# EAGLE schematic RX8E+ulrich (EAGLE 6.6.0)

## Sheet 1 of 4
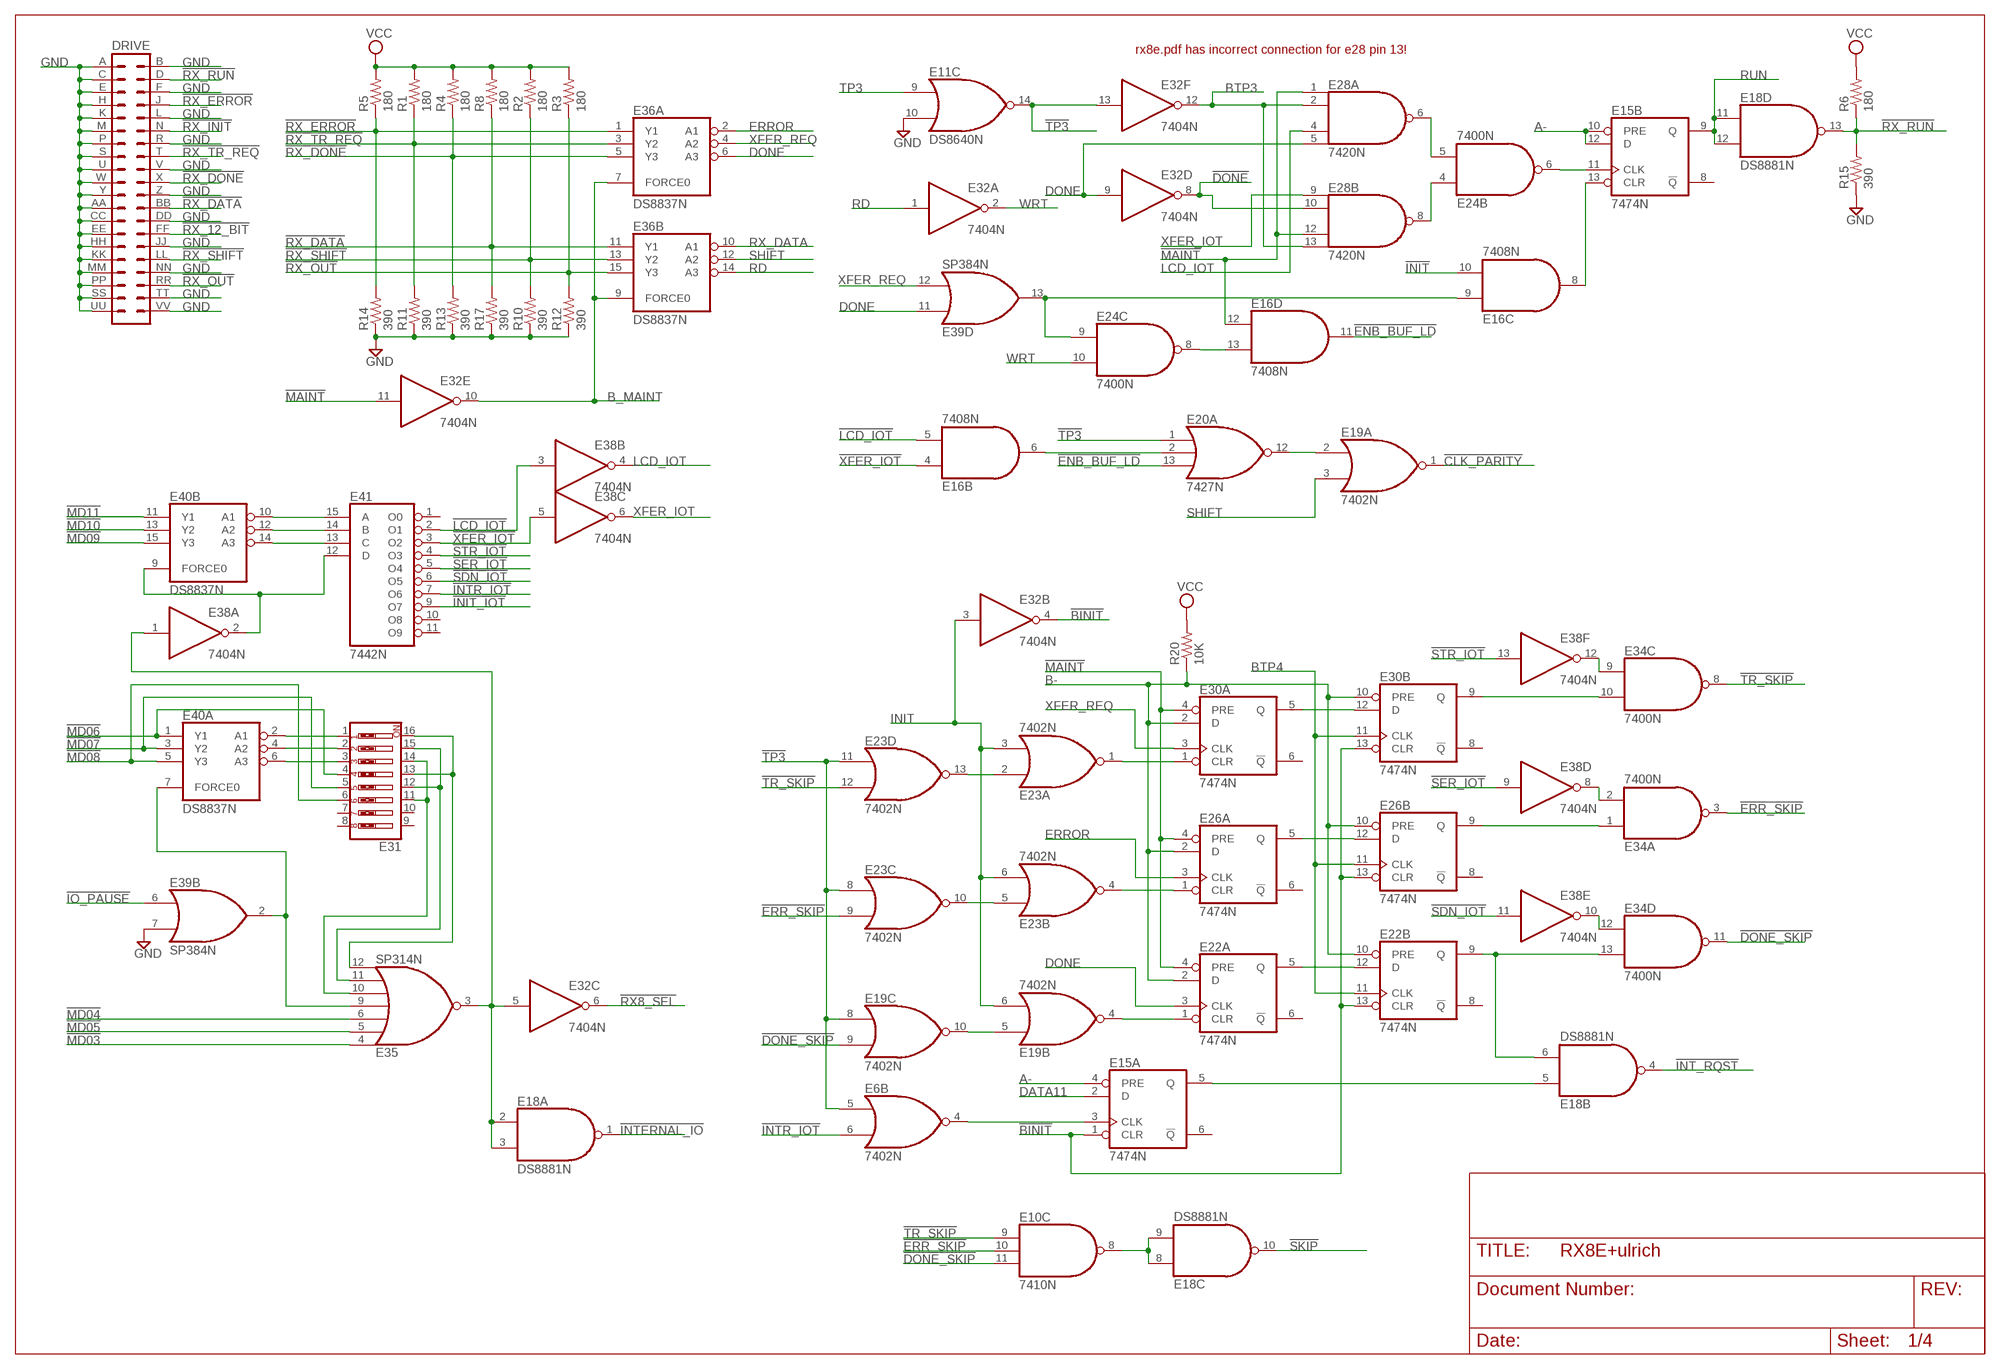
[diagram p0: schematic, sheet 1]

### Parts
DRIVE  DEC40PINH  [DEC40PINH]
E6  7402N  74LS02N  [DIL14]
E10  7410N  74LS10N  [DIL14]
E11  DS8640N  [DIL14]
E15  7474N  74LS74N  [DIL14]
E16  7408N  74LS08N  [DIL14]
E18  DS8881N  74LS01N  [DIL14]
E19  7402N  74LS02N  [DIL14]
E20  7427N  74LS27N  [DIL14]
E22  7474N  74LS74N  [DIL14]
E23  7402N  74LS02N  [DIL14]
E24  7400N  74LS00N  [DIL14]
E26  7474N  74LS74N  [DIL14]
E28  7420N  74LS20N  [DIL14]
E30  7474N  74LS74N  [DIL14]
E31  SW_DIP-8  [EDG-08]
E32  7404N  74LS04N  [DIL14]
E34  7400N  [DIL14]
E35  SP314N  [DIL14]
E36  DS8837N  [DIL16]
E38  7404N  74LS04N  [DIL14]
E39  SP384N  [DIL14]
E40  DS8837N  [DIL16]
E41  7442N  74LS42N  [DIL16]
R1  180  R-US_0207/10  [0207/10]
R2  180  R-US_0207/10  [0207/10]
R3  180  R-US_0207/10  [0207/10]
R4  180  R-US_0207/10  [0207/10]
R5  180  R-US_0207/10  [0207/10]
R6  180  R-US_0207/10  [0207/10]
R8  180  R-US_0207/10  [0207/10]
R10  390  R-US_0207/10  [0207/10]
R11  390  R-US_0207/10  [0207/10]
R12  390  R-US_0207/10  [0207/10]
R13  390  R-US_0207/10  [0207/10]
R14  390  R-US_0207/10  [0207/10]
R15  390  R-US_0207/10  [0207/10]
R17  390  R-US_0207/10  [0207/10]
R20  10K  R-US_0207/10  [0207/10]

### Nets
!BINIT: E15.1(A:CLR) E22.13(B:CLR) E26.13(B:CLR) E30.13(B:CLR) E32.4(B:O)
!CLK_PARITY: E19.1(A:O) ; also sheet 2
!DONE: E28.10(B:I1) E32.8(D:O) ; also sheet 2
!DONE_SKIP: E10.11(C:I2) E19.9(C:I1) E34.11(D:O) ; also sheet 3
!ENB_BUF_LD: E16.11(D:O) E20.13(A:I2) ; also sheet 2
!ERR_SKIP: E10.10(C:I1) E23.9(C:I1) E34.3(A:O)
!INIT: E16.10(C:I1) ; also sheet 2
!INIT_IOT: E41.9(O7) ; also sheet 2
!INT_RQST: E18.4(B:O) ; also sheet 3
!INTERNAL_IO: E18.1(A:O) ; also sheet 3
!INTR_IOT: E6.6(B:I1) E41.7(O6)
!IO_PAUSE: E39.6(B:I0) ; also sheet 3
!LCD_IOT: E16.5(B:I1) E38.3(B:I) E41.2(O1) ; also sheet 2
!MAINT: E16.12(D:I0) E22.4(A:PRE) E26.4(A:PRE) E28.1(A:I0) E28.12(B:I2) E30.4(A:PRE) E32.11(E:I) ; also sheet 2
!MD03: E35.4(I0) ; also sheet 3
!MD04: E35.6(I2) ; also sheet 3
!MD05: E35.5(I1) ; also sheet 3
!MD06: E31.4 E40.1(A:Y1) ; also sheet 3
!MD07: E31.5 E40.3(A:Y2) ; also sheet 3
!MD08: E31.6 E40.5(A:Y3) ; also sheet 3
!MD09: E40.15(B:Y3) ; also sheet 3
!MD10: E40.13(B:Y2) ; also sheet 3
!MD11: E40.11(B:Y1) ; also sheet 3
!RX8_SEL: E32.6(C:O) ; also sheet 2
!RX_12_BIT: DRIVE.FF ; also sheet 2
!RX_DATA: DRIVE.BB E36.11(B:Y1) R8.1 R17.2 ; also sheet 2
!RX_DONE: DRIVE.X E36.5(A:Y3) R4.1 R13.2
!RX_ERROR: DRIVE.J E36.1(A:Y1) R5.1 R14.2
!RX_INIT: DRIVE.N ; also sheet 2
!RX_OUT: DRIVE.RR E36.15(B:Y3) R3.1 R12.2
!RX_RUN: DRIVE.D E18.13(D:O) R6.1 R15.2
!RX_SHIFT: DRIVE.LL E36.13(B:Y2) R2.1 R10.2
!RX_TR_REQ: DRIVE.T E36.3(A:Y2) R1.1 R11.2
!SDN_IOT: E38.11(E:I) E41.6(O5)
!SER_IOT: E38.9(D:I) E41.5(O4)
!SKIP: E18.10(C:O) ; also sheet 3
!STR_IOT: E38.13(F:I) E41.4(O3)
!TP3: E6.5(B:I0) E11.14(C:O) E19.8(C:I0) E20.1(A:I0) E23.8(C:I0) E23.11(D:I0) E32.13(F:I) ; also sheet 2
!TR_SKIP: E10.9(C:I0) E23.12(D:I1) E34.8(C:O) ; also sheet 3
!XFER_IOT: E16.4(B:I0) E38.5(C:I) E41.3(O2) ; also sheet 2
A-: E15.4(A:PRE) E15.10(B:PRE) E15.12(B:D) ; also sheet 2
B-: E22.2(A:D) E22.10(B:PRE) E26.2(A:D) E26.10(B:PRE) E30.2(A:D) E30.10(B:PRE) R20.1 ; also sheet 2
B_MAINT: E32.10(E:O) E36.7(A:FORCE0) E36.9(B:FORCE0)
BTP3: E28.2(A:I1) E28.13(B:I3) E32.12(F:O) ; also sheet 2
BTP4: E22.11(B:CLK) E26.11(B:CLK) E30.11(B:CLK) ; also sheet 2
DATA11: E15.2(A:D) ; also sheet 2
DONE: E22.3(A:CLK) E28.5(A:I3) E32.9(D:I) E36.6(A:A3) E39.11(D:I0) ; also sheet 2
ERROR: E26.3(A:CLK) E36.2(A:A1)
GND [supply]: DRIVE.A DRIVE.AA DRIVE.B DRIVE.C DRIVE.CC DRIVE.DD DRIVE.E DRIVE.EE DRIVE.F DRIVE.H DRIVE.HH DRIVE.JJ DRIVE.K DRIVE.KK DRIVE.L DRIVE.M DRIVE.MM DRIVE.NN DRIVE.P DRIVE.PP DRIVE.R DRIVE.S DRIVE.SS DRIVE.TT DRIVE.U DRIVE.UU DRIVE.V DRIVE.VV DRIVE.W DRIVE.Y DRIVE.Z E11.10(C:I1) E39.7(B:I1) R10.1 R11.1 R12.1 R13.1 R14.1 R15.1 R17.1 ; also sheet 2,3,4
INIT: E19.6(B:I1) E23.3(A:I1) E23.6(B:I1) E32.3(B:I) ; also sheet 2
LCD_IOT: E28.4(A:I2) E38.4(B:O) ; also sheet 2
N$1: E31.11 E31.14 E35.10(I4)
N$5: E31.12 E31.15 E35.11(I5)
N$6: E31.13 E31.16 E35.12(I6)
N$7: E31.3 E40.6(A:A3)
N$8: E31.2 E40.4(A:A2)
N$9: E31.1 E40.2(A:A1)
N$10: E35.9(I3) E39.2(B:O) E40.7(A:FORCE0)
N$11: E18.2(A:I0) E18.3(A:I1) E32.5(C:I) E35.3(O) E38.1(A:I)
N$49: E19.5(B:I0) E19.10(C:O)
N$50: E38.2(A:O) E40.9(B:FORCE0) E41.12(D)
N$51: E40.14(B:A3) E41.13(C)
N$52: E40.12(B:A2) E41.14(B)
N$53: E40.10(B:A1) E41.15(A)
N$54: E19.4(B:O) E22.1(A:CLR)
N$55: E23.4(B:O) E26.1(A:CLR)
N$56: E23.5(B:I0) E23.10(C:O)
N$57: E23.2(A:I0) E23.13(D:O)
N$58: E23.1(A:O) E30.1(A:CLR)
N$59: E30.5(A:Q) E30.12(B:D)
N$61: E26.5(A:Q) E26.12(B:D)
N$68: E22.5(A:Q) E22.12(B:D)
N$69: E18.6(B:I1) E22.9(B:Q) E34.13(D:I1)
N$70: E26.9(B:Q) E34.1(A:I0)
N$71: E6.4(B:O) E15.3(A:CLK)
N$72: E30.9(B:Q) E34.10(C:I1)
N$73: E34.2(A:I1) E38.8(D:O)
N$74: E34.12(D:I0) E38.10(E:O)
N$75: E34.9(C:I0) E38.12(F:O)
N$76: E15.5(A:Q) E18.5(B:I0)
N$77: E10.8(C:O) E18.8(C:I0) E18.9(C:I1)
N$78: E24.5(B:I1) E28.6(A:O)
N$79: E16.6(B:O) E20.2(A:I1)
N$80: E24.4(B:I0) E28.8(B:O)
N$81: E16.9(C:I0) E24.9(C:I0) E39.13(D:O)
N$82: E16.13(D:I1) E24.8(C:O)
N$83: E15.13(B:CLR) E16.8(C:O)
N$84: E19.2(A:I0) E20.12(A:O)
N$85: E15.11(B:CLK) E24.6(B:O)
RD: E32.1(A:I) E36.14(B:A3) ; also sheet 2
RUN: E15.9(B:Q) E18.11(D:I0) E18.12(D:I1) ; also sheet 2
RX_DATA: E36.10(B:A1) ; also sheet 2
SHIFT: E19.3(A:I1) E36.12(B:A2)
TP3: E11.9(C:I0) ; also sheet 3,4
VCC [supply]: R1.2 R2.2 R3.2 R4.2 R5.2 R6.2 R8.2 R20.2 ; also sheet 2,3
WRT: E24.10(C:I1) E32.2(A:O) ; also sheet 2
XFER_IOT: E28.9(B:I0) E38.6(C:O) ; also sheet 2
XFER_REQ: E30.3(A:CLK) E36.4(A:A2) E39.12(D:I1)
Unconnected: E6.8(C:I0) E6.9(C:I1) E6.10(C:O) E11.11(D:I0) E11.12(D:I1) E11.13(D:O) E15.6(A:!Q) E15.8(B:!Q) E20.3(B:I0) E20.4(B:I1) E20.5(B:I2) E20.6(B:O) E22.6(A:!Q) E22.8(B:!Q) E26.6(A:!Q) E26.8(B:!Q) E30.6(A:!Q) E30.8(B:!Q) E31.7 E31.8 E31.9 E31.10 E34.4(B:I0) E34.5(B:I1) E34.6(B:O) E39.3(A:O) E39.4(A:I0) E39.5(A:I1) E39.9(C:I0) E39.10(C:I1) E39.14(C:O) E41.1(O0) E41.10(O8) E41.11(O9)

### Notes on the sheet
- rx8e.pdf has incorrect connection for e28 pin 13!

## Sheet 2 of 4
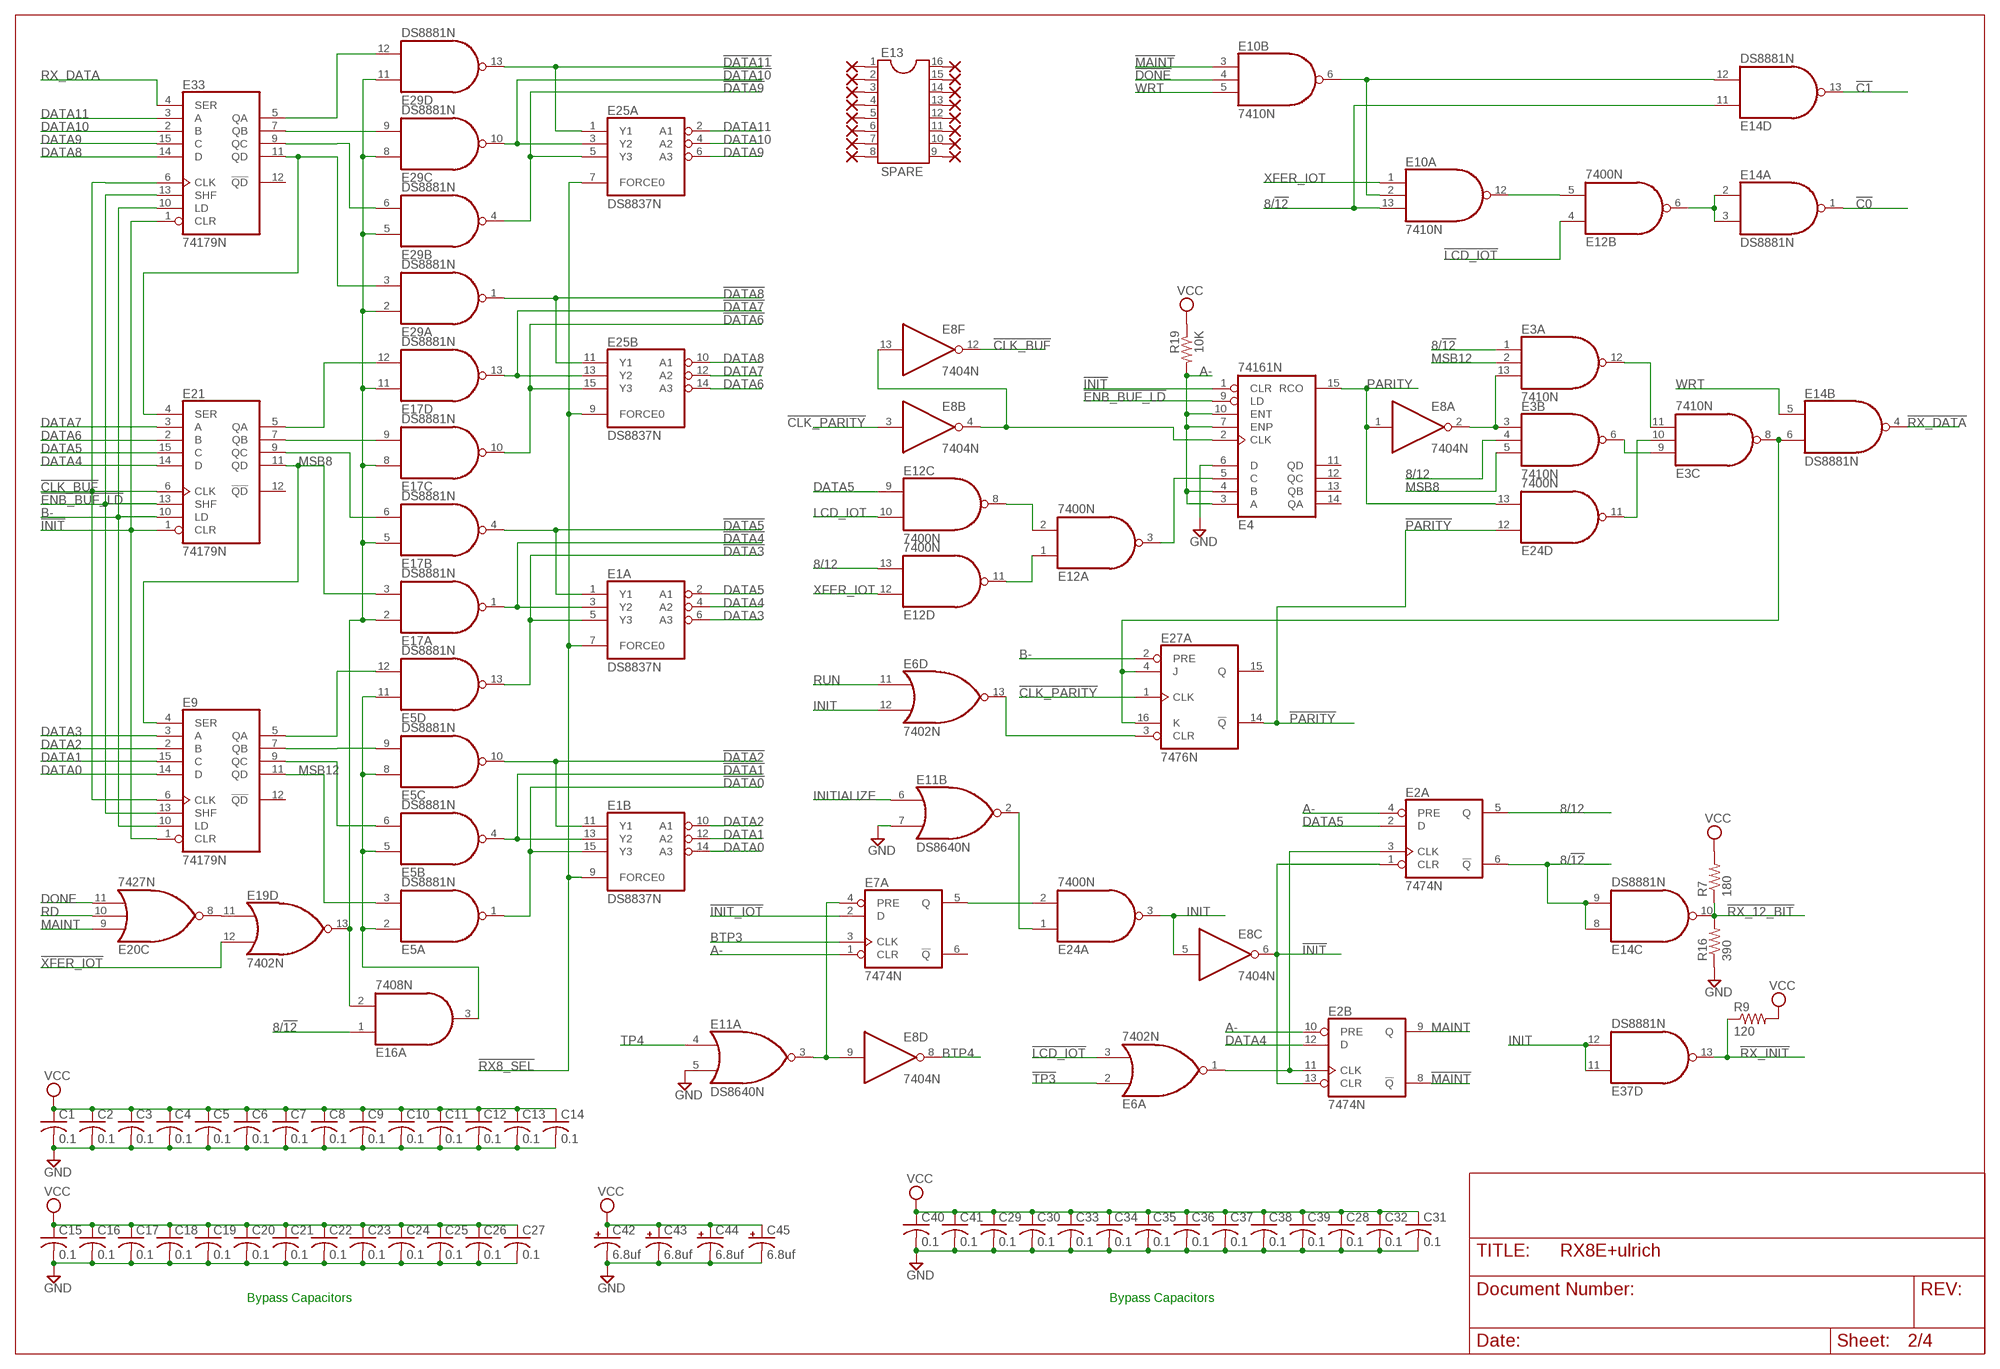
[diagram p1: schematic, sheet 2]

### Parts
C1  0.1  C-US050-025X075  [C050-025X075]
C2  0.1  C-US050-025X075  [C050-025X075]
C3  0.1  C-US050-025X075  [C050-025X075]
C4  0.1  C-US050-025X075  [C050-025X075]
C5  0.1  C-US050-025X075  [C050-025X075]
C6  0.1  C-US050-025X075  [C050-025X075]
C7  0.1  C-US050-025X075  [C050-025X075]
C8  0.1  C-US050-025X075  [C050-025X075]
C9  0.1  C-US050-025X075  [C050-025X075]
C10  0.1  C-US050-025X075  [C050-025X075]
C11  0.1  C-US050-025X075  [C050-025X075]
C12  0.1  C-US050-025X075  [C050-025X075]
C13  0.1  C-US050-025X075  [C050-025X075]
C14  0.1  C-US050-025X075  [C050-025X075]
C15  0.1  C-US050-025X075  [C050-025X075]
C16  0.1  C-US050-025X075  [C050-025X075]
C17  0.1  C-US050-025X075  [C050-025X075]
C18  0.1  C-US050-025X075  [C050-025X075]
C19  0.1  C-US050-025X075  [C050-025X075]
C20  0.1  C-US050-025X075  [C050-025X075]
C21  0.1  C-US050-025X075  [C050-025X075]
C22  0.1  C-US050-025X075  [C050-025X075]
C23  0.1  C-US050-025X075  [C050-025X075]
C24  0.1  C-US050-025X075  [C050-025X075]
C25  0.1  C-US050-025X075  [C050-025X075]
C26  0.1  C-US050-025X075  [C050-025X075]
C27  0.1  C-US050-025X075  [C050-025X075]
C28  0.1  C-US050-025X075  [C050-025X075]
C29  0.1  C-US050-025X075  [C050-025X075]
C30  0.1  C-US050-025X075  [C050-025X075]
C31  0.1  C-US050-025X075  [C050-025X075]
C32  0.1  C-US050-025X075  [C050-025X075]
C33  0.1  C-US050-025X075  [C050-025X075]
C34  0.1  C-US050-025X075  [C050-025X075]
C35  0.1  C-US050-025X075  [C050-025X075]
C36  0.1  C-US050-025X075  [C050-025X075]
C37  0.1  C-US050-025X075  [C050-025X075]
C38  0.1  C-US050-025X075  [C050-025X075]
C39  0.1  C-US050-025X075  [C050-025X075]
C40  0.1  C-US050-025X075  [C050-025X075]
C41  0.1  C-US050-025X075  [C050-025X075]
C42  6.8uf  CPOL-USE22-6AXIAL  [E22-6]
C43  6.8uf  CPOL-USE22-6AXIAL  [E22-6]
C44  6.8uf  CPOL-USE22-6AXIAL  [E22-6]
C45  6.8uf  CPOL-USE22-6AXIAL  [E22-6]
E1  DS8837N  [DIL16]
E2  7474N  74LS74N  [DIL14]
E3  7410N  74LS10N  [DIL14]
E4  74161N  [DIL16]
E5  DS8881N  74LS01N  [DIL14]
E7  7474N  74LS74N  [DIL14]
E8  7404N  74LS04N  [DIL14]
E9  74179N  [DIL16]
E12  7400N  74LS00N  [DIL14]
E13  SPARE  DIL16  [DIL16]
E14  DS8881N  74LS01N  [DIL14]
E17  DS8881N  74LS01N  [DIL14]
E21  74179N  [DIL16]
E25  DS8837N  [DIL16]
E27  7476N  [DIL16]
E29  DS8881N  74LS01N  [DIL14]
E33  74179N  [DIL16]
E37  DS8881N  74LS01N  [DIL14]
PAD10  1,6/0,8  [1,6/0,8]
PAD11  1,6/0,8  [1,6/0,8]
PAD12  1,6/0,8  [1,6/0,8]
PAD13  1,6/0,8  [1,6/0,8]
PAD14  1,6/0,8  [1,6/0,8]
PAD15  1,6/0,8  [1,6/0,8]
PAD16  1,6/0,8  [1,6/0,8]
PAD17  1,6/0,8  [1,6/0,8]
PAD20  1,6/0,8  [1,6/0,8]
PAD21  1,6/0,8  [1,6/0,8]
PAD22  1,6/0,8  [1,6/0,8]
PAD23  1,6/0,8  [1,6/0,8]
PAD24  1,6/0,8  [1,6/0,8]
PAD25  1,6/0,8  [1,6/0,8]
PAD26  1,6/0,8  [1,6/0,8]
PAD27  1,6/0,8  [1,6/0,8]
R7  180  R-US_0207/10  [0207/10]
R9  120  R-US_0207/10  [0207/10]
R16  390  R-US_0207/10  [0207/10]
R19  10K  R-US_0207/10  [0207/10]

### Nets
8/12: E2.5(A:Q) E3.4(B:I1) E12.13(D:I1)
8/!12: E2.6(A:!Q) E3.1(A:I0) E10.13(A:I2) E14.8(C:I0) E14.9(C:I1) E14.11(D:I0) E16.1(A:I0)
!C0: E14.1(A:O) ; also sheet 3
!C1: E14.13(D:O) ; also sheet 3
!CLK_BUF: E8.12(F:O) E9.6(CLK) E21.6(CLK) E33.6(CLK)
!CLK_PARITY: E8.3(B:I) E27.1(A:CLK) ; also sheet 1
!DATA0: E1.15(B:Y3) E5.1(A:O) ; also sheet 3
!DATA1: E1.13(B:Y2) E5.4(B:O) ; also sheet 3
!DATA2: E1.11(B:Y1) E5.10(C:O) ; also sheet 3
!DATA3: E1.5(A:Y3) E5.13(D:O) ; also sheet 3
!DATA4: E1.3(A:Y2) E17.1(A:O) ; also sheet 3
!DATA5: E1.1(A:Y1) E17.4(B:O) ; also sheet 3
!DATA6: E17.10(C:O) E25.15(B:Y3) ; also sheet 3
!DATA7: E17.13(D:O) E25.13(B:Y2) ; also sheet 3
!DATA8: E25.11(B:Y1) E29.1(A:O) ; also sheet 3
!DATA9: E25.5(A:Y3) E29.4(B:O) ; also sheet 3
!DATA10: E25.3(A:Y2) E29.10(C:O) ; also sheet 3
!DATA11: E25.1(A:Y1) E29.13(D:O) ; also sheet 3
!DONE: E10.4(B:I1) ; also sheet 1
!ENB_BUF_LD: E4.9(LD) E9.13(SHF) E21.13(SHF) E33.13(SHF) ; also sheet 1
!INIT: E2.1(A:CLR) E2.13(B:CLR) E4.1(CLR) E8.6(C:O) E9.1(CLR) E21.1(CLR) E33.1(CLR) ; also sheet 1
!INIT_IOT: E7.2(A:D) ; also sheet 1
!LCD_IOT: E6.3(A:I1) E12.4(B:I0) ; also sheet 1
!MAINT: E2.8(B:!Q) E10.3(B:I0) ; also sheet 1
!PARITY: E24.12(D:I0) E27.14(A:!Q)
!RX8_SEL: E1.7(A:FORCE0) E1.9(B:FORCE0) E25.7(A:FORCE0) E25.9(B:FORCE0) ; also sheet 1
!RX_12_BIT: E14.10(C:O) R7.1 R16.2 ; also sheet 1
!RX_DATA: E14.4(B:O) ; also sheet 1
!RX_INIT: E37.13(D:O) R9.1 ; also sheet 1
!TP3: E6.2(A:I0) ; also sheet 1
!XFER_IOT: E19.12(D:I1) ; also sheet 1
A-: E2.4(A:PRE) E2.10(B:PRE) E4.3(A) E4.4(B) E4.7(ENP) E4.10(ENT) E7.1(A:CLR) R19.2 ; also sheet 1
B-: E9.10(LD) E21.10(LD) E27.2(A:PRE) E33.10(LD) ; also sheet 1
BTP3: E7.3(A:CLK) ; also sheet 1
BTP4: E8.8(D:O) ; also sheet 1
DATA0: E1.14(B:A3) E9.14(D)
DATA1: E1.12(B:A2) E9.15(C)
DATA2: E1.10(B:A1) E9.2(B)
DATA3: E1.6(A:A3) E9.3(A)
DATA4: E1.4(A:A2) E2.12(B:D) E21.14(D)
DATA5: E1.2(A:A1) E2.2(A:D) E12.9(C:I0) E21.15(C)
DATA6: E21.2(B) E25.14(B:A3)
DATA7: E21.3(A) E25.12(B:A2)
DATA8: E25.10(B:A1) E33.14(D)
DATA9: E25.6(A:A3) E33.15(C)
DATA10: E25.4(A:A2) E33.2(B)
DATA11: E25.2(A:A1) E33.3(A) ; also sheet 1
DONE: E20.11(C:I2) ; also sheet 1
GND [supply]: C1.2 C2.2 C3.2 C4.2 C5.2 C6.2 C7.2 C8.2 C9.2 C10.2 C11.2 C12.2 C13.2 C14.2 C15.2 C16.2 C17.2 C18.2 C19.2 C20.2 C21.2 C22.2 C23.2 C24.2 C25.2 C26.2 C27.2 C28.2 C29.2 C30.2 C31.2 C32.2 C33.2 C34.2 C35.2 C36.2 C37.2 C38.2 C39.2 C40.2 C41.2 C42.- C43.- C44.- C45.- E4.6(D) E11.5(A:I1) E11.7(B:I1) R16.1 ; also sheet 1,3,4
INIT: E6.12(D:I1) E8.5(C:I) E24.3(A:O) E37.11(D:I0) E37.12(D:I1) ; also sheet 1
INITIALIZE: E11.6(B:I0) ; also sheet 3
LCD_IOT: E12.10(C:I1) ; also sheet 1
MAINT: E2.9(B:Q) E20.9(C:I0)
MSB8: E3.5(B:I2) E9.4(SER) E17.3(A:I1) E21.11(QD)
MSB12: E3.2(A:I1) E5.3(A:I1) E9.11(QD)
N$2: E5.9(C:I1) E9.7(QB)
N$3: E16.2(A:I1) E17.2(A:I0) E17.5(B:I0) E17.8(C:I0) E17.11(D:I0) E19.13(D:O) E29.2(A:I0) E29.5(B:I0) E29.8(C:I0) E29.11(D:I0)
N$4: E19.11(D:I0) E20.8(C:O)
N$12: E5.2(A:I0) E5.5(B:I0) E5.8(C:I0) E5.11(D:I0) E16.3(A:O)
N$13: E13.1 PAD10.1(P)
N$14: E13.2 PAD11.1(P)
N$15: E13.3 PAD12.1(P)
N$16: E13.4 PAD13.1(P)
N$17: E13.5 PAD14.1(P)
N$18: E13.6 PAD15.1(P)
N$19: E13.7 PAD16.1(P)
N$20: E13.8 PAD17.1(P)
N$21: E4.5(C) E12.3(A:O)
N$22: E12.6(B:O) E14.2(A:I0) E14.3(A:I1)
N$23: E13.16 PAD20.1(P)
N$24: E13.15 PAD21.1(P)
N$25: E13.14 PAD22.1(P)
N$26: E13.13 PAD23.1(P)
N$27: E13.12 PAD24.1(P)
N$28: E13.11 PAD25.1(P)
N$29: E13.10 PAD26.1(P)
N$30: E13.9 PAD27.1(P)
N$31: E21.4(SER) E29.3(A:I1) E33.11(QD)
N$32: E10.12(A:O) E12.5(B:I1)
N$33: E5.6(B:I1) E9.9(QC)
N$34: E10.2(A:I1) E10.6(B:O) E14.12(D:I1)
N$35: E12.1(A:I0) E12.11(D:O)
N$36: E12.2(A:I1) E12.8(C:O)
N$37: E3.3(B:I0) E3.13(A:I2) E8.2(A:O)
N$38: E3.11(C:I2) E3.12(A:O)
N$39: E3.6(B:O) E3.9(C:I0)
N$40: E3.10(C:I1) E24.11(D:O)
N$42: E3.8(C:O) E14.6(B:I1) E27.4(A:J) E27.16(A:K)
N$43: E7.4(A:PRE) E8.9(D:I) E11.3(A:O)
N$44: E4.2(CLK) E8.4(B:O) E8.13(F:I)
N$45: E7.5(A:Q) E24.2(A:I1)
N$46: E6.13(D:O) E27.3(A:CLR)
N$47: E11.2(B:O) E24.1(A:I0)
N$48: E2.3(A:CLK) E2.11(B:CLK) E6.1(A:O)
N$60: E5.12(D:I1) E9.5(QA)
N$62: E17.6(B:I1) E21.9(QC)
N$63: E17.9(C:I1) E21.7(QB)
N$64: E17.12(D:I1) E21.5(QA)
N$65: E29.12(D:I1) E33.5(QA)
N$66: E29.6(B:I1) E33.9(QC)
N$67: E29.9(C:I1) E33.7(QB)
PARITY: E4.15(RCO) E8.1(A:I) E24.13(D:I1) ; also sheet 3
RD: E20.10(C:I1) ; also sheet 1
RUN: E6.11(D:I0) ; also sheet 1
RX_DATA: E33.4(SER) ; also sheet 1
TP4: E11.4(A:I0) ; also sheet 3,4
VCC [supply]: C1.1 C2.1 C3.1 C4.1 C5.1 C6.1 C7.1 C8.1 C9.1 C10.1 C11.1 C12.1 C13.1 C14.1 C15.1 C16.1 C17.1 C18.1 C19.1 C20.1 C21.1 C22.1 C23.1 C24.1 C25.1 C26.1 C27.1 C28.1 C29.1 C30.1 C31.1 C32.1 C33.1 C34.1 C35.1 C36.1 C37.1 C38.1 C39.1 C40.1 C41.1 C42.+ C43.+ C44.+ C45.+ R7.2 R9.2 R19.1 ; also sheet 1,3
WRT: E10.5(B:I2) E14.5(B:I0) ; also sheet 1
XFER_IOT: E10.1(A:I0) E12.12(D:I0) ; also sheet 1
Unconnected: E4.11(QD) E4.12(QC) E4.13(QB) E4.14(QA) E7.6(A:!Q) E7.8(B:!Q) E7.9(B:Q) E7.10(B:PRE) E7.11(B:CLK) E7.12(B:D) E7.13(B:CLR) E8.10(E:O) E8.11(E:I) E9.12(!QD) E21.12(!QD) E27.6(B:CLK) E27.7(B:PRE) E27.8(B:CLR) E27.9(B:J) E27.10(B:!Q) E27.11(B:Q) E27.12(B:K) E27.15(A:Q) E33.12(!QD) E37.1(A:O) E37.2(A:I0) E37.3(A:I1) E37.4(B:O) E37.5(B:I0) E37.6(B:I1) E37.8(C:I0) E37.9(C:I1) E37.10(C:O)

### Notes on the sheet
- Bypass Capacitors | Bypass Capacitors

## Sheet 3 of 4
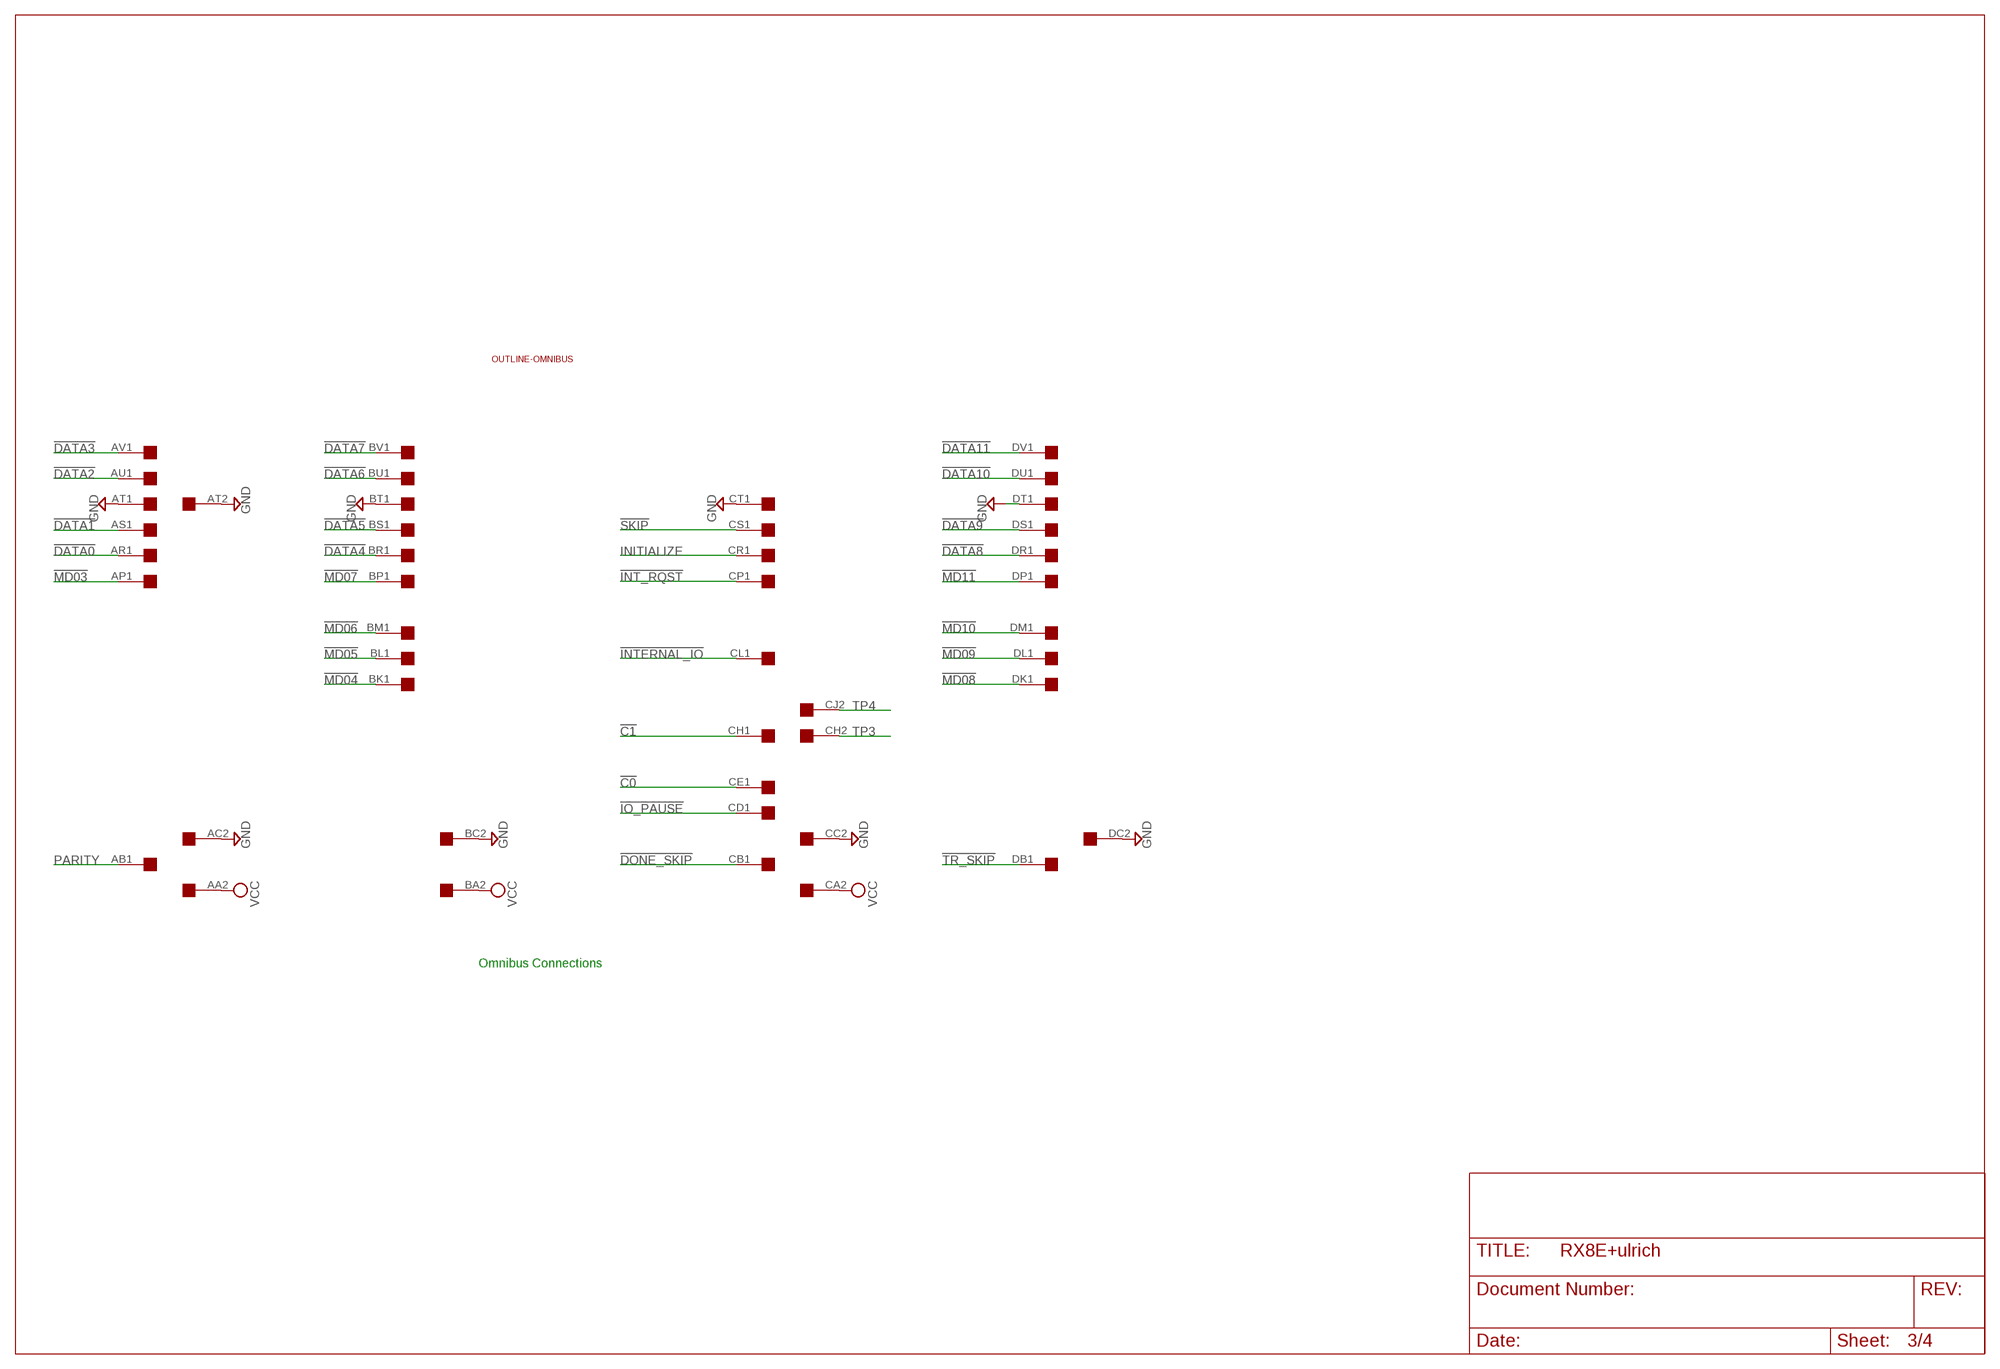
[diagram p2: schematic, sheet 3]

### Parts
U$2  QUAD  [EDGE-CON8]
U$5  OUTLINE-OMNIBUS  [OMNIBUS]

### Nets
!C0: U$2.CE1 ; also sheet 2
!C1: U$2.CH1 ; also sheet 2
!DATA0: U$2.AR1 ; also sheet 2
!DATA1: U$2.AS1 ; also sheet 2
!DATA2: U$2.AU1 ; also sheet 2
!DATA3: U$2.AV1 ; also sheet 2
!DATA4: U$2.BR1 ; also sheet 2
!DATA5: U$2.BS1 ; also sheet 2
!DATA6: U$2.BU1 ; also sheet 2
!DATA7: U$2.BV1 ; also sheet 2
!DATA8: U$2.DR1 ; also sheet 2
!DATA9: U$2.DS1 ; also sheet 2
!DATA10: U$2.DU1 ; also sheet 2
!DATA11: U$2.DV1 ; also sheet 2
!DONE_SKIP: U$2.CB1 ; also sheet 1
!INT_RQST: U$2.CP1 ; also sheet 1
!INTERNAL_IO: U$2.CL1 ; also sheet 1
!IO_PAUSE: U$2.CD1 ; also sheet 1
!MD03: U$2.AP1 ; also sheet 1
!MD04: U$2.BK1 ; also sheet 1
!MD05: U$2.BL1 ; also sheet 1
!MD06: U$2.BM1 ; also sheet 1
!MD07: U$2.BP1 ; also sheet 1
!MD08: U$2.DK1 ; also sheet 1
!MD09: U$2.DL1 ; also sheet 1
!MD10: U$2.DM1 ; also sheet 1
!MD11: U$2.DP1 ; also sheet 1
!SKIP: U$2.CS1 ; also sheet 1
!TR_SKIP: U$2.DB1 ; also sheet 1
GND [supply]: U$2.AC2 U$2.AT1 U$2.AT2 U$2.BC2 U$2.BT1 U$2.CC2 U$2.CT1 U$2.DC2 U$2.DT1 ; also sheet 1,2,4
INITIALIZE: U$2.CR1 ; also sheet 2
PARITY: U$2.AB1 ; also sheet 2
TP3: U$2.CH2 ; also sheet 1,4
TP4: U$2.CJ2 ; also sheet 2,4
VCC [supply]: U$2.AA2 U$2.BA2 U$2.CA2 ; also sheet 1,2
Unconnected: U$2.AA1 U$2.AB2 U$2.AC1 U$2.AD1 U$2.AD2 U$2.AE1 U$2.AE2 U$2.AF1 U$2.AF2 U$2.AH1 U$2.AH2 U$2.AJ1 U$2.AJ2 U$2.AK1 U$2.AK2 U$2.AL1 U$2.AL2 U$2.AM1 U$2.AM2 U$2.AN1 U$2.AN2 U$2.AP2 U$2.AR2 U$2.AS2 U$2.AU2 U$2.AV2 U$2.BA1 U$2.BB1 U$2.BB2 U$2.BC1 U$2.BD1 U$2.BD2 U$2.BE1 U$2.BE2 U$2.BF1 U$2.BF2 U$2.BH1 U$2.BH2 U$2.BJ1 U$2.BJ2 U$2.BK2 U$2.BL2 U$2.BM2 U$2.BN1 U$2.BN2 U$2.BP2 U$2.BR2 U$2.BS2 U$2.BT2 U$2.BU2 U$2.BV2 U$2.CA1 U$2.CB2 U$2.CC1 U$2.CD2 U$2.CE2 U$2.CF1 U$2.CF2 U$2.CJ1 U$2.CK1 U$2.CK2 U$2.CL2 U$2.CM1 U$2.CM2 U$2.CN1 U$2.CN2 U$2.CP2 U$2.CR2 U$2.CS2 U$2.CT2 U$2.CU1 U$2.CU2 U$2.CV1 U$2.CV2 U$2.DA1 U$2.DA2 U$2.DB2 U$2.DC1 U$2.DD1 U$2.DD2 U$2.DE1 U$2.DE2 U$2.DF1 U$2.DF2 U$2.DH1 U$2.DH2 U$2.DJ1 U$2.DJ2 U$2.DK2 U$2.DL2 U$2.DM2 U$2.DN1 U$2.DN2 U$2.DP2 U$2.DR2 U$2.DS2 U$2.DT2 U$2.DU2 U$2.DV2

### Notes on the sheet
- Omnibus Connections

## Sheet 4 of 4
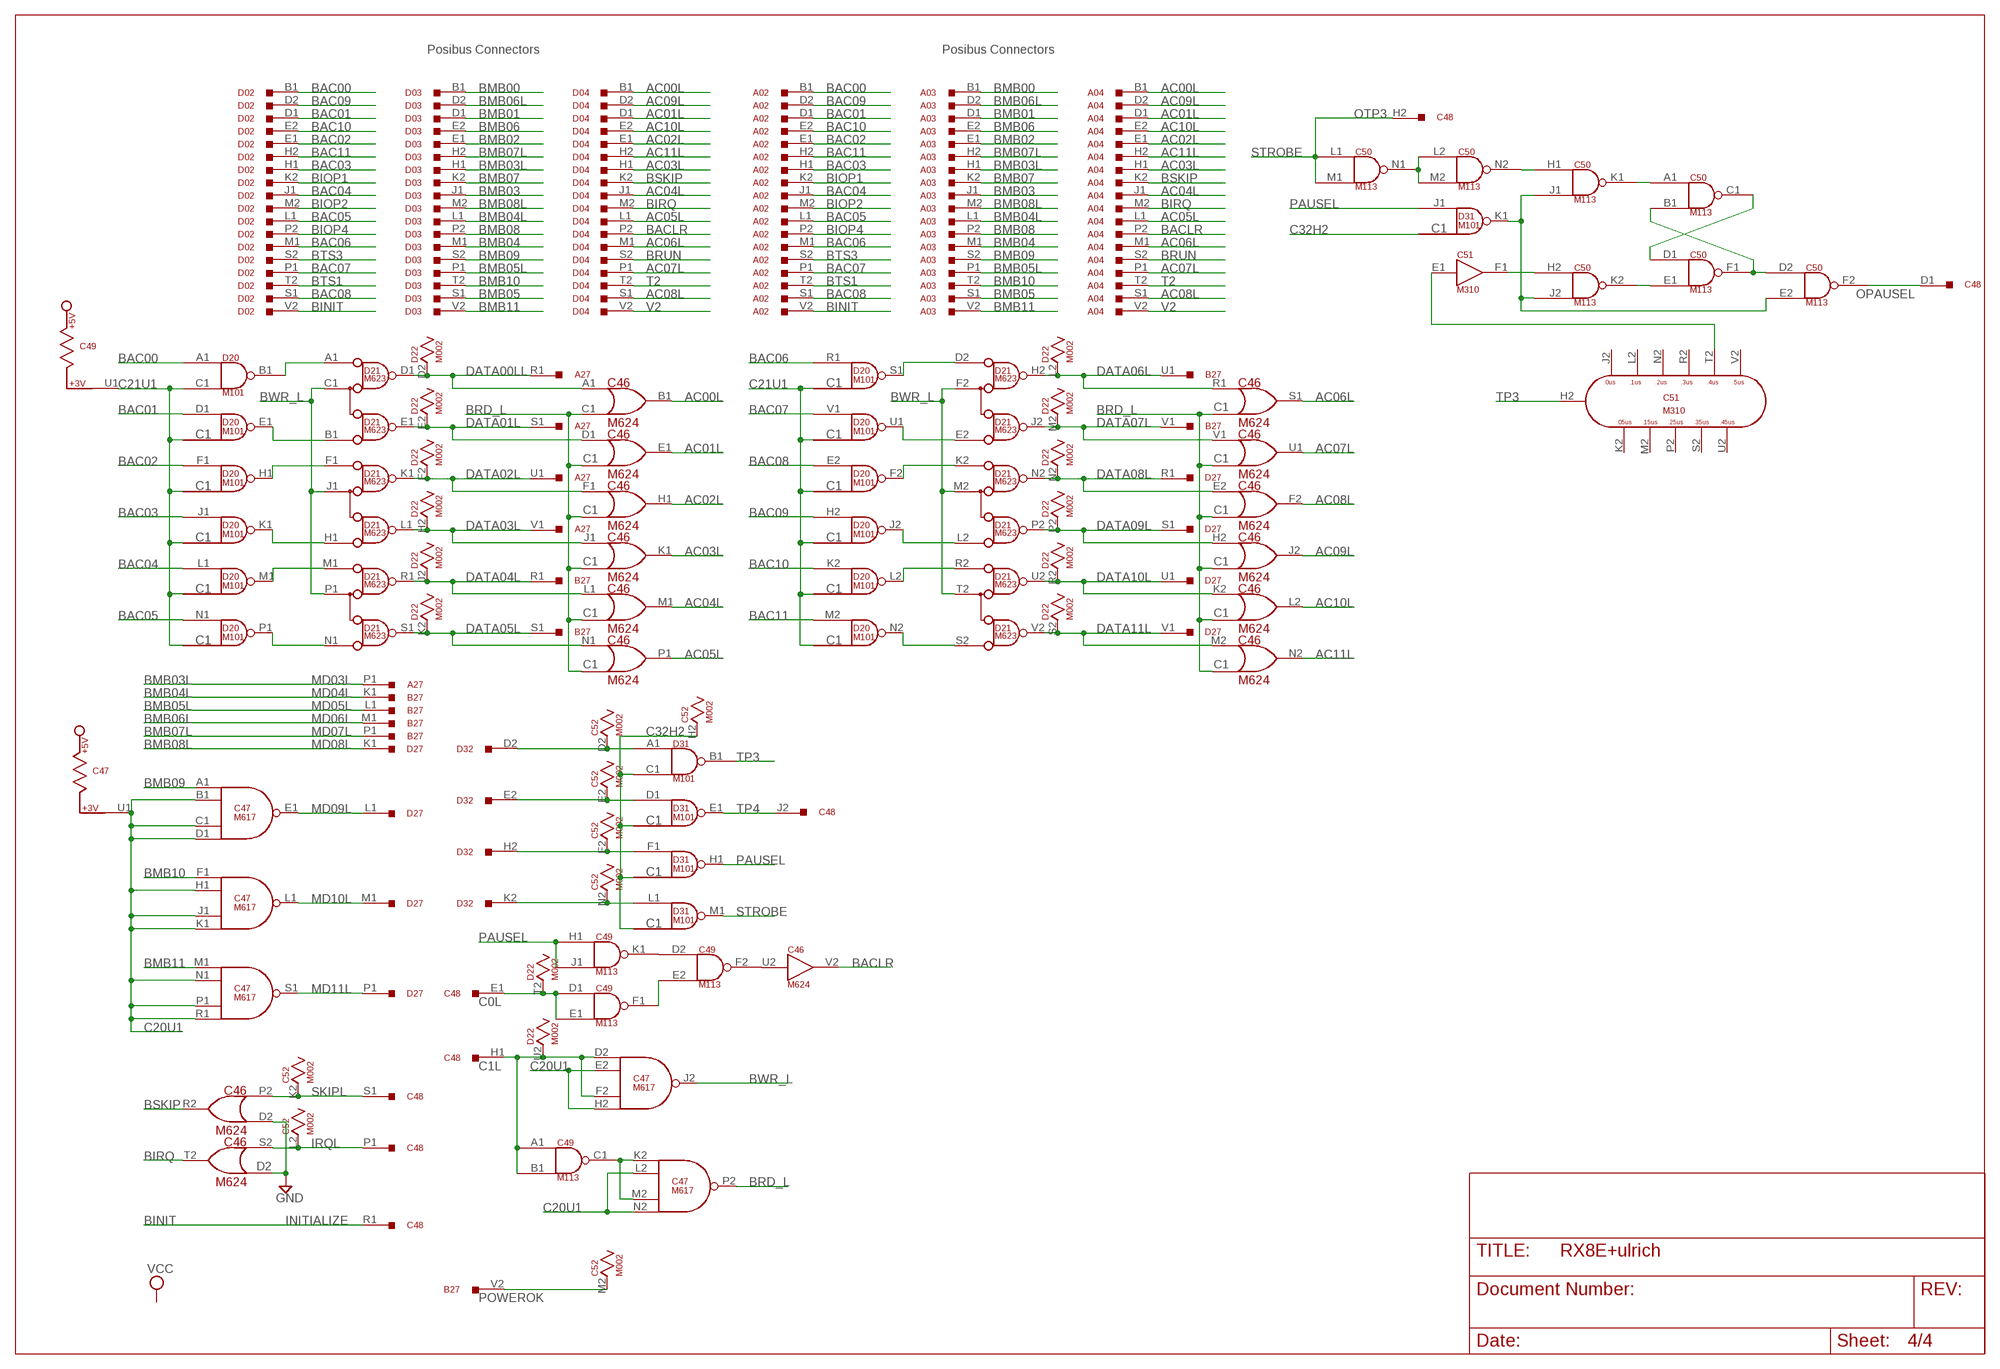
[diagram p3: schematic, sheet 4]

### Parts
A02  M903  [H807]
A03  M903  [H807]
A04  M903  [H807]
A27  M916  [H807]
B27  M916  [H807]
C46  M624  [H807]
C47  M617  [H807]
C48  M916  [H807]
C49  M113  [H807]
C50  M113  [H807]
C51  M310  [H807]
C52  M002  [H807]
D02  M903  [H807]
D03  M903  [H807]
D04  M903  [H807]
D20  M101  [H807]
D21  M623  [H807]
D22  M002  [H807]
D27  M916  [H807]
D31  M101  [H807]
D32  M903  [H807]

### Nets
AC00L: A04.B1 C46.B1(B1:OUT) D04.B1
AC01L: A04.D1 C46.E1(E1:OUT) D04.D1
AC02L: A04.E1 C46.H1(H1:OUT) D04.E1
AC03L: A04.H1 C46.K1(K1:OUT) D04.H1
AC04L: A04.J1 C46.M1(M1:OUT) D04.J1
AC05L: A04.L1 C46.P1(P1:OUT) D04.L1
AC06L: A04.M1 C46.S1(S1:OUT) D04.M1
AC07L: A04.P1 C46.U1(U1:OUT) D04.P1
AC08L: A04.S1 C46.F2(F2:OUT) D04.S1
AC09L: A04.D2 C46.J2(J2:OUT) D04.D2
AC10L: A04.E2 C46.L2(L2:OUT) D04.E2
AC11L: A04.H2 C46.N2(N2:OUT) D04.H2
BAC00: A02.B1 D02.B1 D20.A1(B1:IN1)
BAC01: A02.D1 D02.D1 D20.D1(E1:IN)
BAC02: A02.E1 D02.E1 D20.F1(H1:IN)
BAC03: A02.H1 D02.H1 D20.J1(K1:IN)
BAC04: A02.J1 D02.J1 D20.L1(M1:IN)
BAC05: A02.L1 D02.L1 D20.N1(P1:IN)
BAC06: A02.M1 D02.M1 D20.R1(S1:IN)
BAC07: A02.P1 D02.P1 D20.V1(U1:IN)
BAC08: A02.S1 D02.S1 D20.E2(F2:IN)
BAC09: A02.D2 D02.D2 D20.H2(J2:IN)
BAC10: A02.E2 D02.E2 D20.K2(L2:IN)
BAC11: A02.H2 D02.H2 D20.M2(N2:IN)
BACLR: A04.P2 C46.V2(V2:OUT) D04.P2
BINIT: A02.V2 C48.R1 D02.V2
BIOP1: A02.K2 D02.K2
BIOP2: A02.M2 D02.M2
BIOP4: A02.P2 D02.P2
BIRQ: A04.M2 C46.T2(T2:OUT) D04.M2
BMB00: A03.B1 D03.B1
BMB01: A03.D1 D03.D1
BMB02: A03.E1 D03.E1
BMB03: A03.J1 D03.J1
BMB03L: A03.H1 A27.P1 D03.H1
BMB04: A03.M1 D03.M1
BMB04L: A03.L1 B27.K1 D03.L1
BMB05: A03.S1 D03.S1
BMB05L: A03.P1 B27.L1 D03.P1
BMB06: A03.E2 D03.E2
BMB06L: A03.D2 B27.M1 D03.D2
BMB07: A03.K2 D03.K2
BMB07L: A03.H2 B27.P1 D03.H2
BMB08: A03.P2 D03.P2
BMB08L: A03.M2 D03.M2 D27.K1
BMB09: A03.S2 C47.A1(E1:IN1) D03.S2
BMB10: A03.T2 C47.F1(L1:IN1) D03.T2
BMB11: A03.V2 C47.M1(S1:IN1) D03.V2
BRD_L: C46.C1(B1:IN2) C47.P2(P2:OUT)
BRUN: A04.S2 D04.S2
BSKIP: A04.K2 C46.R2(R2:OUT) D04.K2
BTS1: A02.T2 D02.T2
BTS3: A02.S2 D02.S2
BWR_L: C47.J2(J2:OUT) D21.C1(D1:C) D21.F2(H2:C) D21.J1(K1:C) D21.M2(N2:C) D21.P1(R1:C) D21.T2(U2:C)
C0L: C48.E1 C49.D1(F1:IN1) C49.E1(F1:IN2) D22.T2
C1L: C47.D2(J2:IN1) C47.F2(J2:IN3) C48.H1 C49.A1(C1:IN1) C49.B1(C1:IN2) D22.U2
C20U1: C47.B1(E1:IN2) C47.C1(E1:IN3) C47.D1(E1:IN4) C47.E2(J2:IN2) C47.H1(L1:IN2) C47.H2(J2:IN4) C47.J1(L1:IN3) C47.K1(L1:IN4) C47.L2(P2:IN2) C47.N1(S1:IN2) C47.N2(P2:IN4) C47.P1(S1:IN3) C47.R1(S1:IN4) C47.U1
C21U1: C49.U1 D20.C1(B1:IN2)
C32H2: C52.H2 D31.C1(B1:IN2)
DATA00LL: A27.R1 C46.A1(B1:IN1) D21.D1(D1:D) D22.D2
DATA01L: A27.S1 C46.D1(E1:IN) D21.E1(D1:E) D22.E2
DATA02L: A27.U1 C46.F1(H1:IN) D21.K1(K1:D) D22.F2
DATA03L: A27.V1 C46.J1(K1:IN) D21.L1(K1:E) D22.H2
DATA04L: B27.R1 C46.L1(M1:IN) D21.R1(R1:D) D22.J2
DATA05L: B27.S1 C46.N1(P1:IN) D21.S1(R1:E) D22.K2
DATA06L: B27.U1 C46.R1(S1:IN) D21.H2(H2:D) D22.L2
DATA07L: B27.V1 C46.V1(U1:IN) D21.J2(H2:E) D22.M2
DATA08L: C46.E2(F2:IN) D21.N2(N2:D) D22.N2 D27.R1
DATA09L: C46.H2(J2:IN) D21.P2(N2:E) D22.P2 D27.S1
DATA10L: C46.K2(L2:IN) D21.U2(U2:D) D22.R2 D27.U1
DATA11L: C46.M2(N2:IN) D21.V2(U2:E) D22.S2 D27.V1
GND [supply]: C46.D2(R2:IN2) ; also sheet 1,2,3
IRQL: C46.S2(T2:IN) C48.P1 C52.L2
MD09L: C47.E1(E1:OUT) D27.L1
MD10L: C47.L1(L1:OUT) D27.M1
MD11L: C47.S1(S1:OUT) D27.P1
N$41: D20.B1(B1:OUT) D21.A1(D1:A)
N$86: D20.E1(E1:OUT) D21.B1(D1:B)
N$87: D20.H1(H1:OUT) D21.F1(K1:A)
N$88: D20.K1(K1:OUT) D21.H1(K1:B)
N$89: D20.P1(P1:OUT) D21.N1(R1:B)
N$90: D20.M1(M1:OUT) D21.M1(R1:A)
N$91: D20.N2(N2:OUT) D21.S2(U2:B)
N$92: D20.J2(J2:OUT) D21.L2(N2:B)
N$93: D20.U1(U1:OUT) D21.E2(H2:B)
N$94: D20.S1(S1:OUT) D21.D2(H2:A)
N$95: D20.F2(F2:OUT) D21.K2(N2:A)
N$96: D20.L2(L2:OUT) D21.R2(U2:A)
N$97: C52.D2 D31.A1(B1:IN1) D32.D2
N$98: C52.E2 D31.D1(E1:IN) D32.E2
N$99: C52.F2 D31.F1(H1:IN) D32.H2
N$100: C52.N2 D31.L1(M1:IN) D32.K2
N$101: C49.E2(F2:IN2) C49.F1(F1:OUT)
N$102: C49.D2(F2:IN1) C49.K1(K1:OUT)
N$103: C46.U2(V2:IN) C49.F2(F2:OUT)
N$104: C47.K2(P2:IN1) C47.M2(P2:IN3) C49.C1(C1:OUT)
N$105: C50.C1(C1:OUT) C50.D1(F1:IN1)
N$106: C50.B1(C1:IN2) C50.D2(F2:IN1) C50.F1(F1:OUT)
N$107: C51.E1(F1:IN) C51.T2(H2:T2)
N$108: C50.H2(K2:IN1) C51.F1(F1:OUT)
N$109: C50.L2(N2:IN1) C50.M2(N2:IN2) C50.N1(N1:OUT)
N$110: C50.H1(K1:IN1) C50.N2(N2:OUT)
N$111: C50.A1(C1:IN1) C50.K1(K1:OUT)
N$112: C50.E2(F2:IN2) C50.J1(K1:IN2) C50.J2(K2:IN2) D31.K1(K1:OUT)
N$113: C50.E1(F1:IN2) C50.K2(K2:OUT)
OPAUSEL: C48.D1 C50.F2(F2:OUT)
PAUSEL: C49.H1(K1:IN1) C49.J1(K1:IN2) D31.H1(H1:OUT) D31.J1(K1:IN)
POWEROK: B27.V2 C52.M2
SKIPL: C46.P2(R2:IN1) C48.S1 C52.K2
STROBE: C48.H2 C50.L1(N1:IN1) C50.M1(N1:IN2) D31.M1(M1:OUT)
T2: A04.T2 D04.T2
TP3: C51.H2(H2:H2) D31.B1(B1:OUT) ; also sheet 1,3
TP4: C48.J2 D31.E1(E1:OUT) ; also sheet 2,3
V2: A04.V2 D04.V2
Unconnected: A27.A1 A27.A2 A27.B1 A27.B2 A27.C1 A27.C2 A27.D1 A27.D2 A27.E1 A27.E2 A27.F1 A27.F2 A27.H1 A27.H2 A27.J1 A27.J2 A27.K1 A27.K2 A27.L1 A27.L2 A27.M1 A27.M2 A27.N1 A27.N2 A27.P2 A27.R2 A27.S2 A27.T1 A27.T2 A27.U2 A27.V2 B27.A1 B27.A2 B27.B1 B27.B2 B27.C1 B27.C2 B27.D1 B27.D2 B27.E1 B27.E2 B27.F1 B27.F2 B27.H1 B27.H2 B27.J1 B27.J2 B27.K2 B27.L2 B27.M2 B27.N1 B27.N2 B27.P2 B27.R2 B27.S2 B27.T1 B27.T2 B27.U2 C47.R2(V2:IN1) C47.S2(V2:IN2) C47.T2(V2:IN3) C47.U2(V2:IN4) C47.V1 C47.V2(V2:OUT) C48.A1 C48.A2 C48.B1 C48.B2 C48.C1 C48.C2 C48.D2 C48.E2 C48.F1 C48.F2 C48.J1 C48.K1 C48.K2 C48.L1 C48.L2 C48.M1 C48.M2 C48.N1 C48.N2 C48.P2 C48.R2 C48.S2 C48.T1 C48.T2 C48.U1 C48.U2 C48.V1 C48.V2 C49.H2(K2:IN1) C49.J2(K2:IN2) C49.K2(K2:OUT) C49.L1(N1:IN1) C49.L2(N2:IN1) C49.M1(N1:IN2) C49.M2(N2:IN2) C49.N1(N1:OUT) C49.N2(N2:OUT) C49.P1(S1:IN1) C49.P2(S2:IN1) C49.R1(S1:IN2) C49.R2(S2:IN2) C49.S1(S1:OUT) C49.S2(S2:OUT) C49.T2(V2:IN1) C49.U2(V2:IN2) C49.V1 C49.V2(V2:OUT) C50.P1(S1:IN1) C50.P2(S2:IN1) C50.R1(S1:IN2) C50.R2(S2:IN2) C50.S1(S1:OUT) C50.S2(S2:OUT) C50.T2(V2:IN1) C50.U1 C50.U2(V2:IN2) C50.V1 C50.V2(V2:OUT) C51.H1(J1:IN) C51.J1(J1:OUT) C51.J2(H2:J2) C51.K2(H2:K2) C51.L2(H2:L2) C51.M2(H2:M2) C51.N2(H2:N2) C51.P2(H2:P2) C51.R2(H2:R2) C51.S2(H2:S2) C51.U2(H2:U2) C51.V2(H2:V2) C52.J2 C52.P2 C52.R2 C52.S2 C52.T2 C52.U2 C52.V2 D20.P2(R2:IN) D20.R2(R2:OUT) D20.S2(T2:IN) D20.T2(T2:OUT) D20.U2(V2:IN) D20.V2(V2:OUT) D22.V2 D27.A1 D27.A2 D27.B1 D27.B2 D27.C1 D27.C2 D27.D1 D27.D2 D27.E1 D27.E2 D27.F1 D27.F2 D27.H1 D27.H2 D27.J1 D27.J2 D27.K2 D27.L2 D27.M2 D27.N1 D27.N2 D27.P2 D27.R2 D27.S2 D27.T1 D27.T2 D27.U2 D27.V2 D31.E2(F2:IN) D31.F2(F2:OUT) D31.H2(J2:IN) D31.J2(J2:OUT) D31.K2(L2:IN) D31.L2(L2:OUT) D31.M2(N2:IN) D31.N1(P1:IN) D31.N2(N2:OUT) D31.P1(P1:OUT) D31.P2(R2:IN) D31.R1(S1:IN) D31.R2(R2:OUT) D31.S1(S1:OUT) D31.S2(T2:IN) D31.T2(T2:OUT) D31.U1(U1:OUT) D31.U2(V2:IN) D31.V1(U1:IN) D31.V2(V2:OUT) D32.B1 D32.D1 D32.E1 D32.H1 D32.J1 D32.L1 D32.M1 D32.M2 D32.P1 D32.P2 D32.S1 D32.S2 D32.T2 D32.V2

### Notes on the sheet
- Posibus Connectors | Posibus Connectors
- OTP3
- MD03L
- MD04L
- MD05L
- MD06L
- MD07L
- MD08L
- INITIALIZE

## Power pins joined to a net without a drawn wire
GND: A02.A1 A02.C1 A02.C2 A02.F1 A02.F2 A02.J2 A02.K1 A02.L2 A02.N1 A02.N2 A02.R1 A02.R2 A02.T1 A02.U2 A03.A1 A03.C1 A03.C2 A03.F1 A03.F2 A03.J2 A03.K1 A03.L2 A03.N1 A03.N2 A03.R1 A03.R2 A03.T1 A03.U2 A04.A1 A04.C1 A04.C2 A04.F1 A04.F2 A04.J2 A04.K1 A04.L2 A04.N1 A04.N2 A04.R1 A04.R2 A04.T1 A04.U2 C46.C2(GND) C46.T1(GND) C47.C2(GND) C47.T1(GND) C49.C2(GND) C49.T1(GND) C50.C2(GND) C50.T1(GND) C51.C2(GND) C51.T1(GND) C52.C2(GND) D02.A1 D02.C1 D02.C2 D02.F1 D02.F2 D02.J2 D02.K1 D02.L2 D02.N1 D02.N2 D02.R1 D02.R2 D02.T1 D02.U2 D03.A1 D03.C1 D03.C2 D03.F1 D03.F2 D03.J2 D03.K1 D03.L2 D03.N1 D03.N2 D03.R1 D03.R2 D03.T1 D03.U2 D04.A1 D04.C1 D04.C2 D04.F1 D04.F2 D04.J2 D04.K1 D04.L2 D04.N1 D04.N2 D04.R1 D04.R2 D04.T1 D04.U2 D20.C2(GND) D20.T1(GND) D21.C2(GND) D21.T1(GND) D21.U1(GND) D21.V1(GND) D22.C2(GND) D31.C2(GND) D31.T1(GND) D32.A1 D32.C1 D32.C2 D32.F1 D32.F2 D32.J2 D32.K1 D32.L2 D32.N1 D32.N2 D32.R1 D32.R2 D32.T1 D32.U2 E1.8(P:GND) E2.7(P:GND) E3.7(P:GND) E4.8(GND) E5.7(P:GND) E6.7(P:GND) E7.7(P:GND) E8.7(P:GND) E9.8(GND) E10.7(P:GND) E11.1(P:GND) E12.7(P:GND) E14.7(P:GND) E15.7(P:GND) E16.7(P:GND) E17.7(P:GND) E18.7(P:GND) E19.7(P:GND) E20.7(P:GND) E21.8(GND) E22.7(P:GND) E23.7(P:GND) E24.7(P:GND) E25.8(P:GND) E26.7(P:GND) E27.13(P:GND) E28.7(P:GND) E29.7(P:GND) E30.7(P:GND) E32.7(P:GND) E33.8(GND) E34.7(P:GND) E35.1(GND) E36.8(P:GND) E37.7(P:GND) E38.7(P:GND) E39.1(GND) E40.8(P:GND) E41.8(GND)
VCC: C46.A2(VCC) C47.A2(VCC) C49.A2(VCC) C50.A2(VCC) C51.A2(VCC) C52.A2(VCC) D20.A2(VCC) D21.A2(VCC) D22.A2(VCC) D31.A2(VCC) E1.16(P:VCC) E2.14(P:VCC) E3.14(P:VCC) E4.16(VCC) E5.14(P:VCC) E6.14(P:VCC) E7.14(P:VCC) E8.14(P:VCC) E9.16(VCC) E10.14(P:VCC) E11.8(P:VCC) E12.14(P:VCC) E14.14(P:VCC) E15.14(P:VCC) E16.14(P:VCC) E17.14(P:VCC) E18.14(P:VCC) E19.14(P:VCC) E20.14(P:VCC) E21.16(VCC) E22.14(P:VCC) E23.14(P:VCC) E24.14(P:VCC) E25.16(P:VCC) E26.14(P:VCC) E27.5(P:VCC) E28.14(P:VCC) E29.14(P:VCC) E30.14(P:VCC) E32.14(P:VCC) E33.16(VCC) E34.14(P:VCC) E35.8(VCC) E36.16(P:VCC) E37.14(P:VCC) E38.14(P:VCC) E39.8(VCC) E40.16(P:VCC) E41.16(VCC)

## Library data of the parts
A02-A04 D02-D04 D32 = dec-m:M903: Two-sided Posibus cable/connector.
A27 B27 C48 D27 = dec-m:M916: Simple 36 pin connector/wire cable
C1-C41 = rcl:C-US: CAPACITOR, American symbol
C42-C45 = rcl:CPOL-US: POLARIZED CAPACITOR, American symbol
C46 = dec-m:M624: Bus Data Interface The M101 contains 15 two-input NAND gates. One input of each gate is tied to a common line so that all data signals can be enabled simultaneously. Each data signal presents one TTL load. The common input presents 15 loads. Each output can drive 10 loads. Power: 5V@82ma (max.)
C47 = dec-m:M617: 6 4-input NAND Buffers
C49 C50 = dec-m:M113: 10 2-input NAND Gates
C51 = dec-m:M310: Tapped Delay Line
C52 D22 = dec-m:M002: 15 Clamped Loads
D20 D31 = dec-m:M101: Bus Data Interface The M101 contains 15 two-input NAND gates. One input of each gate is tied to a common line so that all data signals can be enabled simultaneously. Each data signal presents one TTL load. The common input presents 15 loads. Each output can drive 10 loads. Power: 5V@82ma (max.)
D21 = dec-m:M623: 6 Dual Bus Drivers
DRIVE = dec-con:DEC40PIN: PIN HEADER
E1 E25 E36 E40 = dec-con:DS8837: Hex inverting LINE RECEIVER
E2 E7 E15 E22 E26 E30 = 74xx-us:74*74: Dual D type positive edge triggered FLIP FLOP, preset and clear
E3 E10 = 74xx-us:74*10: Triple 3-input NAND gate
E4 = dec-con:74*161: Synchronous 4-bit COUNTER
E5 E14 E17 E18 E29 E37 = 74xx-us:74*01: Quad 2-input NAND gate, open collector
E6 E19 E23 = 74xx-us:74*02: Quad 2-input NOR gate
E8 E32 E38 = 74xx-us:74*04: Hex INVERTER
E9 E21 E33 = 74xx-us:74*179: 4-bit parallel access SHIFT REGISTER
E11 = dec-con:DS8640: Quad NOR gate
E12 E24 E34 = 74xx-us:74*00: Quad 2-input NAND gate
E13 = ic-package:DIL16: Dual In Line / Socket
E16 = 74xx-us:74*08: Quad 2-input AND gate
E20 = 74xx-us:74*27: Triple 3-input NOR gate
E27 = 74xx-us:74*76: Dual J-K FLIP FLOP, preset and clear
E28 = 74xx-us:74*20: Dual 4-input NAND gate
E31 = special:SW_DIP-8: DIP SWITCH
E35 = dec-con:SP314: 7-Input NOR gate
E39 = dec-con:SP384: Quad OR gate
E41 = 74xx-us:74*42: 4-line to 10-line DECODER (1-of-10)
PAD10-PAD17 PAD20-PAD27 = wirepad:1,6/0,8: THROUGH-HOLE PAD
R1-R17 R19 R20 = rcl:R-US_: RESISTOR, American symbol
U$2 = dec-con:QUAD: Quad-Height DEC board
U$5 = dec-con:OUTLINE-*: Board outlines for DEC boards.

## Net classes
1 supply: width 0.762 mm